# Altium schematic sheet HollowClock4.1.SchDoc
size A4; SheetNumber: 1; SheetTotal: 1; SPICEModelCacheGQMECWOA: <root> / <DocumentId>GQMECWOA</DocumentId> / <CacheFrame Number="0"> / <Model Name="skydiode" Kind="MDL"> / <Text>*Default Schottky Diode / *Schottky Diode Pinout: A,K / .MODEL SKYDIODE D(EG=0.69 XTI=2)</Text> / </Model> / </CacheFrame> / </root>
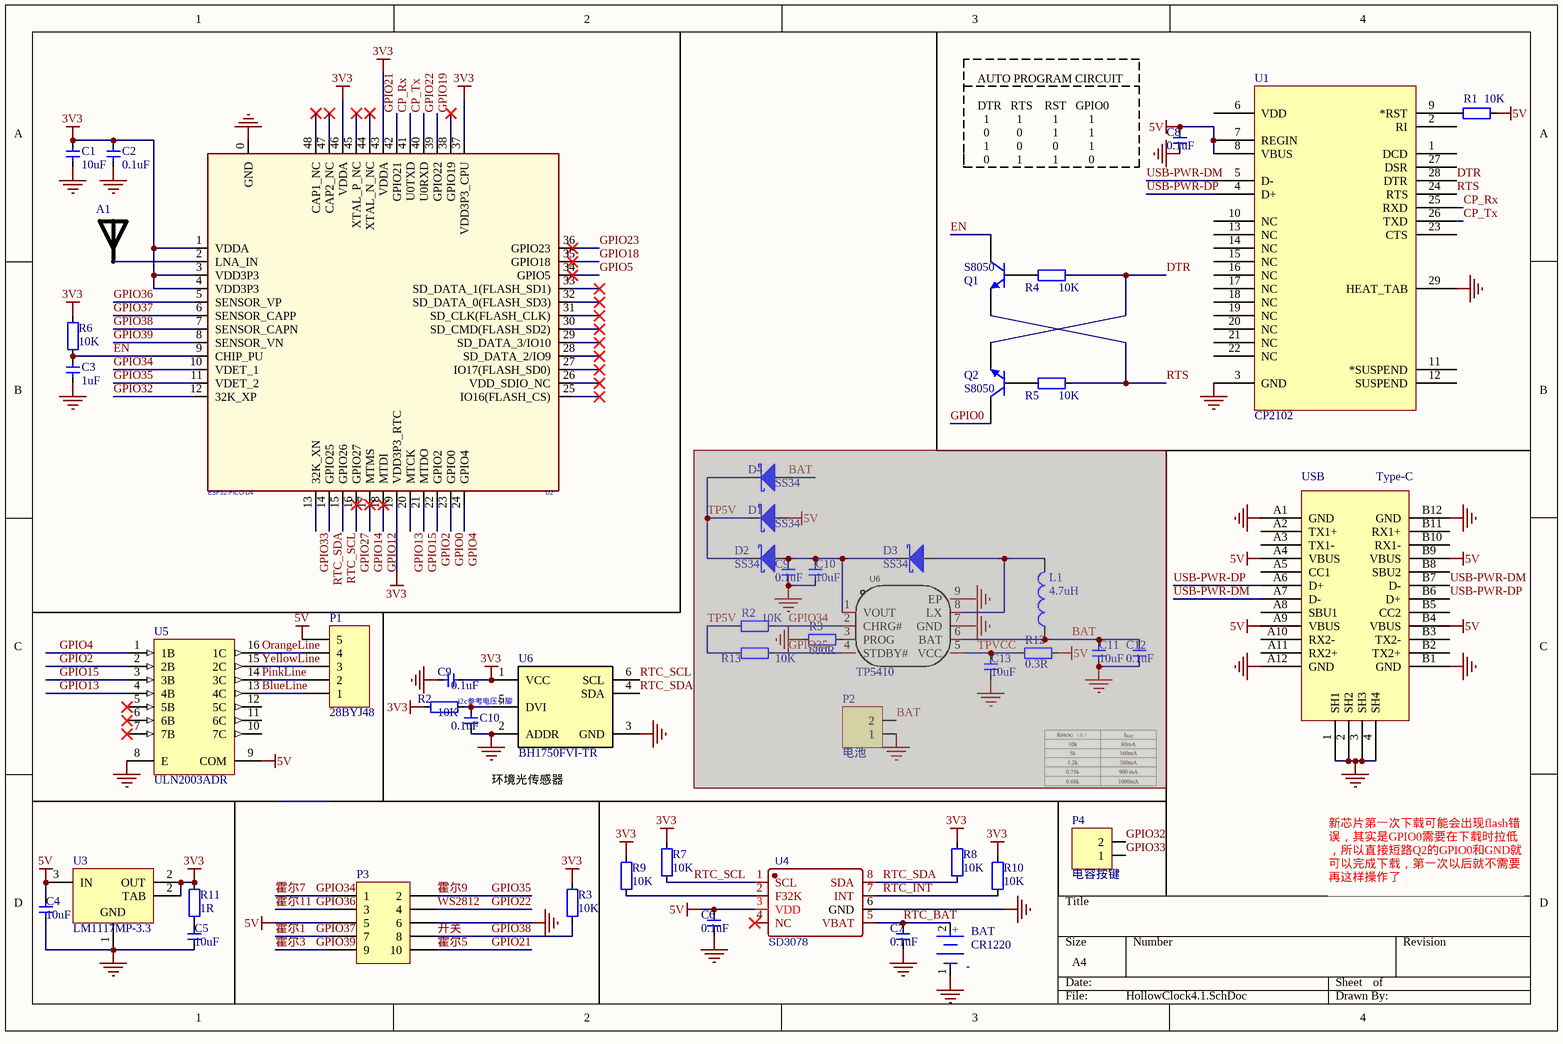
[diagram p0: HollowClock4.1.SchDoc]

## Parts
(Parts that share a designator on the sheet are numbered #1, #2 ... from top to bottom, then left to right.)
A1  RAINSUN  [AN9520]  (value not drawn)
BAT  CR1220  [FP-S8411-45R-MFG]
C1  10uF  [0603_C]
C2  0.1uF  [0603_C]
C3  1uF  [0603_C]
C4  10uF  [0603_C]
C5  10uF  [0603_C]
C6  0.1uF  [0603_C]
C7  0.1uF  [0603_C]
C8  0.1uF  [0603_C]
C9#1  0.1uF  [0603_C]  (masked out: inside a compile mask, not in the netlist)
C9#2  0.1uF  [0603_C]
C10#1  10uF  [0603_C]  (masked out: inside a compile mask, not in the netlist)
C10#2  0.1uF  [0603_C]
C11  10uF  [0603_C]  (masked out: inside a compile mask, not in the netlist)
C12  0.1uF  [0603_C]  (masked out: inside a compile mask, not in the netlist)
C13  10uF  [0603_C]  (masked out: inside a compile mask, not in the netlist)
D1  SS34  [SMA]  (masked out: inside a compile mask, not in the netlist)
D2  SS34  [SMA]  (masked out: inside a compile mask, not in the netlist)
D3  SS34  [SMA]  (masked out: inside a compile mask, not in the netlist)
D4  SS34  [SMA]  (masked out: inside a compile mask, not in the netlist)
L1  value 4.7uH  [CD32]  (hidden comment: Inductor)  (masked out: inside a compile mask, not in the netlist)
P1  28BYJ48  [XH2.54-LI-5P]
P2  电池  [XH2.54-LI-2P]  (masked out: inside a compile mask, not in the netlist)
P3  Header 5X2  [10Pin-2.54-5*2]  (value not drawn)
P4  电容按键  [HDR1X2]
Q1  S8050  [SOT23-3]
Q2  S8050  [SOT23-3]
R1  10K  [0603_R]
R2#1  10K  [0603_R]  (masked out: inside a compile mask, not in the netlist)
R2#2  10K  [0603_R]
R3#1  680R  [0603_R]  (masked out: inside a compile mask, not in the netlist)
R3#2  10K  [0603_R]
R4  10K  [0603_R]
R5  10K  [0603_R]
R6  10K  [0603_R]
R7  10K  [0603_R]
R8  10K  [0603_R]
R9  10K  [0603_R]
R10  10K  [0603_R]
R11  1R  [0603_R]
R12  0.3R  [0603_R]  (masked out: inside a compile mask, not in the netlist)
R13  10K  [0603_R]  (masked out: inside a compile mask, not in the netlist)
U1  CP2102  [QFN28 5x5]
U2  ESP32-PICO-D4  [QFN-48_7X7]
U3  LM1117MP-3.3  [SOT223]
U4  SD3078  [SOP8W]
U5  ULN2003ADR  [D0016A_M]
U6#1  TP5410  [ESOP8]  (masked out: inside a compile mask, not in the netlist)
U6#2  BH1750FVI-TR  [BH1750]
USB  Type-C  [USB Type-C-16Pin_A]

## Nets
3V3: C1.2 C2.2 C9#2.1 R2#2.2 R3#2.1 R6.1 R7.1 R8.1 R9.1 R10.1 R11.1 U2.1(VDDA) U2.3(VDD3P3) U2.4(VDD3P3) U2.19(VDD3P3_RTC) U2.37(VDD3P3_CPU) U2.43(VDDA) U2.46(VDDA) U3.2(OUT) U6#2.1(VCC)
5V: C4.2 C6.2 C8.2 P1.5 P3.5 R1.1 U1.7(REGIN) U1.8(VBUS) U3.3(IN) U4.3(VDD) U5.9(COM) USB.A4(VBUS) USB.A9(VBUS) USB.B4(VBUS) USB.B9(VBUS)
GND: BAT.1(C) C1.1 C2.1 C3.2 C4.1 C5.1 C6.1 C7.1 C8.1 C9#2.2 C10#2.2 P3.6 U1.3(GND) U1.29(HEAT_TAB) U2.0(GND) U3.1(GND) U4.6(GND) U5.8(E) U6#2.2(ADDR) U6#2.3(GND) USB.1(SH1) USB.2(SH2) USB.3(SH3) USB.4(SH4) USB.A1(GND) USB.A12(GND) USB.B1(GND) USB.B12(GND)
BlueLine: P1.1 U5.13(4C)
CP_Rx: U1.25(RXD) U2.41(U0TXD)
CP_Tx: U1.26(TXD) U2.40(U0RXD)
DTR: Q2.2(E) R4.1 U1.28(DTR)
EN: C3.1 Q1.3(C) R6.2 U2.9(CHIP_PU)
GPIO0: Q2.3(C) U2.23(GPIO0)
GPIO2: U2.22(GPIO2) U5.2(2B)
GPIO4: U2.24(GPIO4) U5.1(1B)
GPIO5: U2.34(GPIO5)
GPIO12: U2.18(MTDI)
GPIO13: U2.20(MTCK) U5.4(4B)
GPIO14: U2.17(MTMS)
GPIO15: U2.21(MTDO) U5.3(3B)
GPIO18: U2.35(GPIO18)
GPIO19: U2.38(GPIO19)
GPIO21: P3.10 U2.42(GPIO21)  [also labelled 霍尔5]
GPIO22: P3.4 U2.39(GPIO22)  [also labelled WS2812]
GPIO23: U2.36(GPIO23)
GPIO27: U2.16(GPIO27)
GPIO32: P4.2 U2.12(32K_XP)
GPIO33: P4.1 U2.13(32K_XN)
GPIO34: P3.1 U2.10(VDET_1)  [also labelled 霍尔7]
GPIO35: P3.2 U2.11(VDET_2)  [also labelled 霍尔9]
GPIO36: P3.3 U2.5(SENSOR_VP)  [also labelled 霍尔11]
GPIO37: P3.7 U2.6(SENSOR_CAPP)  [also labelled 霍尔1]
GPIO38: P3.8 R3#2.2 U2.7(SENSOR_CAPN)  [also labelled 开关]
GPIO39: P3.9 U2.8(SENSOR_VN)  [also labelled 霍尔3]
OrangeLine: P1.4 U5.16(1C)
PinkLine: P1.2 U5.14(3C)
RTC_BAT: BAT.2(A) C7.2 U4.5(VBAT)
RTC_INT: R10.2 U4.7(INT)
RTC_SCL: R7.2 U2.15(GPIO26) U4.1(SCL) U6#2.6(SCL)
RTC_SDA: R8.2 U2.14(GPIO25) U4.8(SDA) U6#2.4(SDA)
RTS: Q1.2(E) R5.1 U1.24(RTS)
USB-PWR-DM: U1.5(D-) USB.A7(D-) USB.B7(D-)
USB-PWR-DP: U1.4(D+) USB.A6(D+) USB.B6(D+)
YellowLine: P1.3 U5.15(2C)
NetA1_1: A1.1 U2.2(LNA_IN)
NetC5_2: C5.2 R11.2
NetC10#2_1: C10#2.1 R2#2.1 U6#2.5(DVI)
NetQ1_1: Q1.1(B) R4.2
NetQ2_1: Q2.1(B) R5.2
NetR1_2: R1.2 U1.9(*RST)
NetR9_2: R9.2 U4.2(F32K)

Not connected (* = marked no-connect by the designer): U1 1(DCD) 2(RI) 6(VDD) 10(NC) 11(*SUSPEND) 12(SUSPEND) 13(NC) 14(NC) 15(NC) 16(NC) 17(NC) 18(NC) 19(NC) 20(NC) 21(NC) 22(NC) 23(CTS) 27(DSR); U2 25(IO16(FLASH_CS))* 26(VDD_SDIO_NC)* 27(IO17(FLASH_SD0))* 28(SD_DATA_2/IO9)* 29(SD_DATA_3/IO10)* 30(SD_CMD(FLASH_SD2))* 31(SD_CLK(FLASH_CLK))* 32(SD_DATA_0(FLASH_SD3))* 33(SD_DATA_1(FLASH_SD1))* 44(XTAL_N_NC)* 45(XTAL_P_NC)* 47(CAP2_NC)* 48(CAP1_NC)*; U4 4(NC)*; U5 5(5B)* 6(6B)* 7(7B)* 10(7C) 11(6C) 12(5C); USB A2(TX1+) A3(TX1-) A5(CC1) A8(SBU1) A10(RX2-) A11(RX2+) B2(TX2+) B3(TX2-) B5(CC2) B8(SBU2) B10(RX1-) B11(RX1+)

## Notes on the sheet
- (near C8) AUTO PROGRAM CIRCUIT
  DTR   RTS    RST   GPIO0
  1         1          1          1
  0         0          1          1
  1         0          0          1
  0         1          1          0
- 环境光传感器
- 新芯片第一次下载可能会出现flash错误，其实是GPIO0需要在下载时拉低，所以直接短路Q2的GPIO0和GND就可以完成下载，第一次以后就不需要再这样操作了
- Labels drawn without touching a wire or pin: i2c参考电压引脚
- (in symbol CMP-15817-000007-1) +; -

## Library data of the parts
A1 = ANT-Rainsun-AP5120
BAT = CMP-15817-000007-1: BATTERY HOLDER COIN 12MM SMD; Number of Batteries: 1; Termination: SMD/SMT; Packaging: Tape and Reel; Number of Cells: 1; Package Quantity: 500; Material: Polyphenylene; Contact Plating: Bronze; Min Operating Temperature: -55°C; Mount: Surface Mount; Case/Package: SMD/SMT; Max Operating Temperature: 105°C; REACH SVHC: No SVHC
C1-C8 C9#1 C9#2 C10#1 C10#2 C11-C13 = 电容-0402: Capacitor; Value: 0.1u
D1-D4 = D Schottky: Schottky Diode; Published: 8-Jun-2000; LatestRevisionDate: 17-Jul-2002; LatestRevisionNote: Re-released for DXP Platform.; PackageReference: SMB; Publisher: Altium Limited; PackageDescription: DO-214-AA/SMB; 2 C-Bend Leads; Body 5.3 x 3.6 mm, inc. leads (LxW); Code_JEDEC: DO-214-AA
L1 = Inductor: Code_IEC: 1005; Published: 8-Jun-2000; LatestRevisionDate: 29-May-2009; LatestRevisionNote: IPC-7351 Footprint Added.; PackageReference: 0402-A; Publisher: Altium Limited; PackageDescription: Chip Inductor; Code_JEITA: 0402
P1 = Header 5: Header, 5-Pin; LatestRevisionDate: 17-Jul-2002; LatestRevisionNote: Re-released for DXP Platform.; Publisher: Altium Limited
P2 P4 = Header 2: Header, 2-Pin; LatestRevisionDate: 17-Jul-2002; LatestRevisionNote: Re-released for DXP Platform.; Publisher: Altium Limited
P3 = Header 5X2: Header, 5-Pin, Dual row; LatestRevisionDate: 17-Jul-2002; LatestRevisionNote: Re-released for DXP Platform.; Publisher: Altium Limited
Q1 Q2 = SMT_TRIODE_NPN: Surface mount NPN transistor, package SOT-23
R1 R2#1 R2#2 R3#1 R3#2 R4-R13 = 电阻-0402: Resistor; Value: 22R
U1 = CP2102: USB转TTL; PART DESC: SINGLE-CHIP USB TO UART BRIDGE, QFN28, RoHS.; MFG #1: SILICON LABS; PART NUMBER: CP2102; Value: Value; RefDes: RefDes; Type: DEV
U2 = ESP32-PICO
U3 = PM-REG-LM1086-SOT4: 800mA Low-Dropout Linear Regulator, 4-pin SOT-223; Manufacturer: National Semiconductor; High-Reliability: Y; PackageTopMarking: XYTT*N05A; PowerWise: N; CompType: LDO IC; PackageReference: MP04A; Code_IPC: SOT223-4; Code_JEDEC: TO-261-AA; PinCount: 4; ComponentLink3Description: LM1117 Web Page; PackageVersion: revB, Apr-2003; RoHS: N; ComponentLink4URL: http://www.national.com/packaging/folders/mp04a.html; ComponentLink2URL: http://www.national.com/ds/LM/LM1117.pdf; ComponentLink1URL: http://www.national.com/; ComponentLink1Description: Manufacturer URL; RevisionNote: SCH symbol layout adjusted; DatasheetVersion: Apr-2006; PackageDescription: Molded SOT-223, 6.50 x 3.56 x 1.6mm Body, 4 Lead, 2.3mm Pitch; PartNumber: LM1117MP-3.3; ComponentLink4Description: MP04A Package Page; ComponentLink2Description: LM1117 Datasheet; ComponentLink3URL: http://www.national.com/pf/LM/LM1117.html
U4 = SD3078: BOM_Manufacturer: WAVE(威帆电子); Contributor: lcsc; BOM_Supplier: LCSC; BOM_Supplier Part: C916255; BOM_Manufacturer Part: SD3078; link: https://atta.szlcsc.com/upload/public/pdf/source/20220505/0AE3F2E5FBD9F5D8ADBB440EBFD40241.pdf; BOM_JLCPCB Part Class: Extended Part; spicePre: U; spiceSymbolName: SD3078
U5 = CMP-2000-04953-1: High-Voltage, High-Current Darlington Transistor Array, 0.5 A, 50 V, -20 to 70 degC, 16-Pin SOIC (D), Green (RoHS & no Sb/Br), Tape and Reel; Manufacturer: TexasInstruments; Peak DC Collector Current: 0.5A; Package Version: 4040047-6/M, 06/2011; Maximum Collector Emitter Voltage: 50V; Configuration: Array7; Maximum Collector Emitter Saturation Voltage: 1.1@100mA; Rad Hard: No; Packaging: Tape&Reel; Datasheet URL: http://www.ti.com/general/docs/lit/getliterature.tsp?genericPartNumber=uln2003a&fileType=pdf; Package Reference: D16; Category: DarlingtonBJT; Datasheet Version: Rev. O, 01/2016; Manufacturer URL: http://www.ti.com/; Type: NPN; Package Description: 16-Pin Plastic Small Outline, Body 9.9 x 3.9 mm, Pitch 1.27 mm; Mounting: SurfaceMount; Package: 16SOIC; Package URL: http://www.ti.com/lit/ml/mpds178g/mpds178g.pdf
U6#1 = TP5400: Manufacturer: TOPPOWER(南京拓微); Symbol: TP5400_C2891434; Add into BOM: yes; Name: TP5400; Device: TP5400; LCSC Part Name: TP5400; Supplier Part: C2891434; Manufacturer Part: TP5400; Supplier Footprint: ESOP-8; JLCPCB Part Class: Extended Part; Datasheet: https://atta.szlcsc.com/upload/public/pdf/source/20210909/352D9D40D77A1DD73F7904E364EF004B.pdf; Supplier: LCSC; Convert to PCB: yes
U6#2 = BH1750FVI-TR: 光照传感器
USB = USB-Type-C-TOP